# EasyEDA Pro project ProProject_AT_START_L021_V1.0.epro, schematic AT-START-L021_V1.0

## Sheets
1 AT-Link-EZ V1.4: Create Date: 2024-01-02; Page Name: AT-Link-EZ V1.4; Project Name: AT-START-L021; Schematic Name: AT-START-L021_V1.0; Update Date: 2024-02-21; Company: Artery Technology; Drawed: SD; Page Size: A4; Version: 1.0
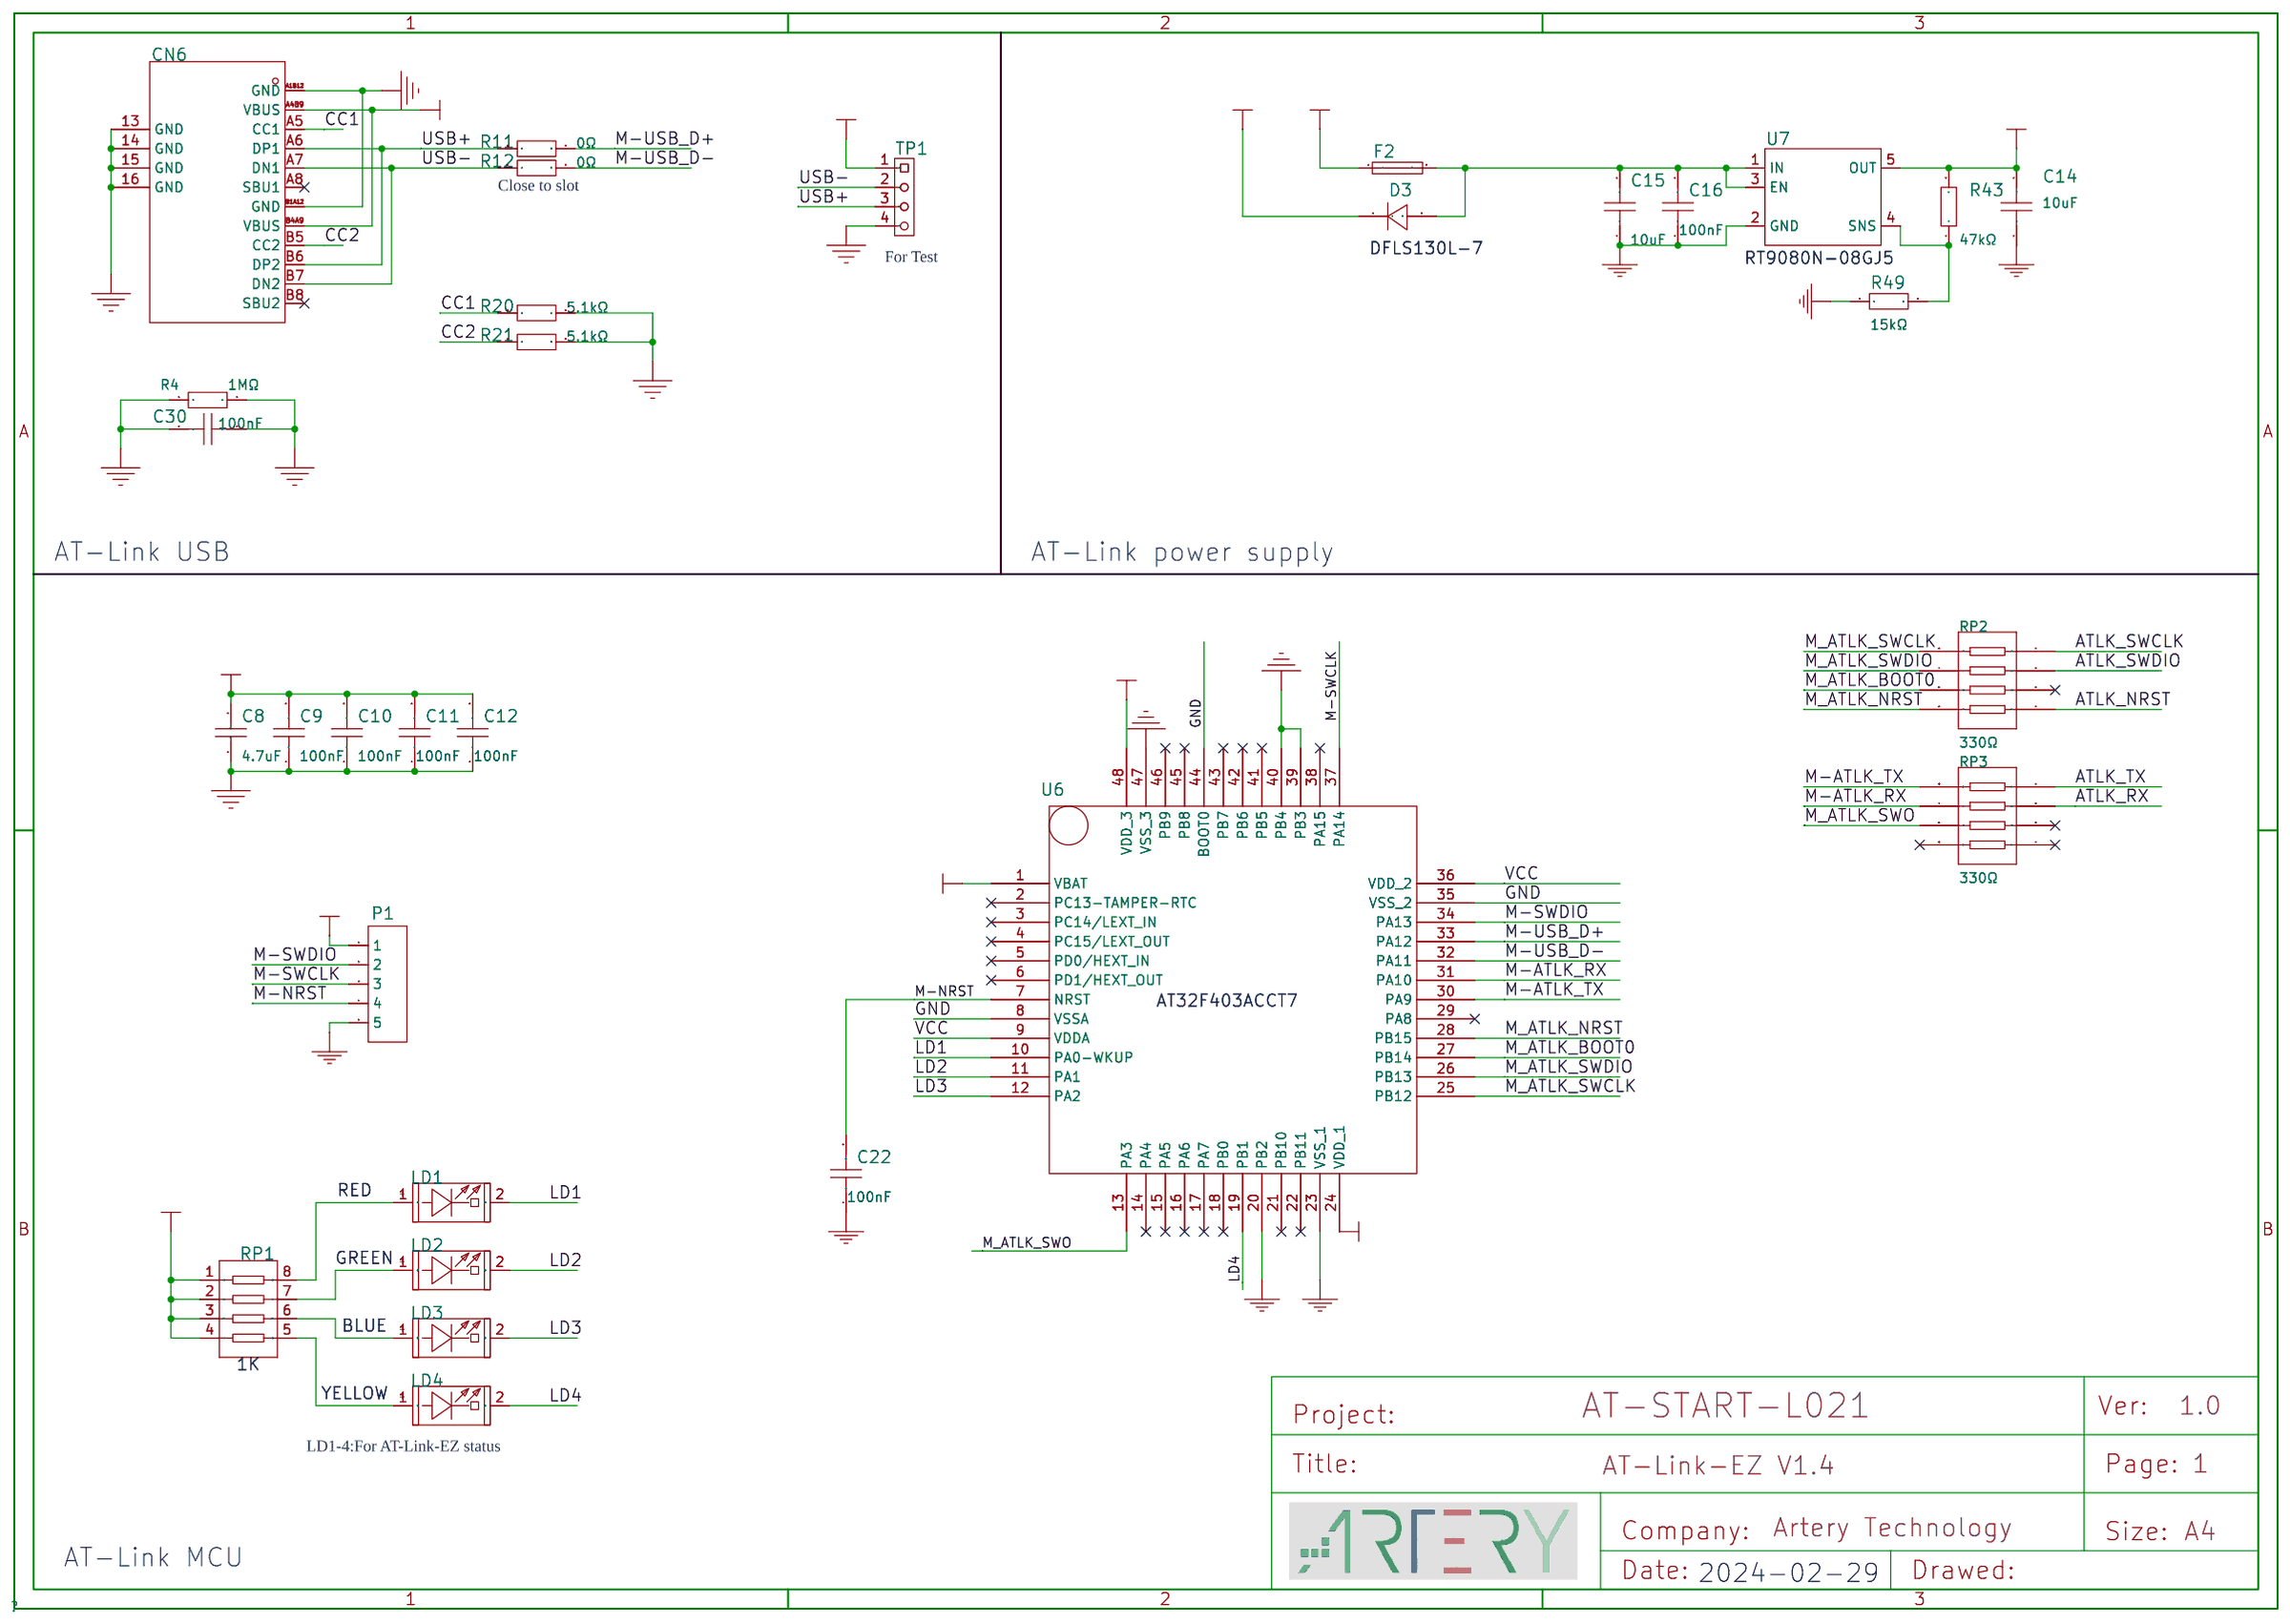
[diagram p0: AT-Link-EZ V1.4]
2 MCU: Page Name: MCU
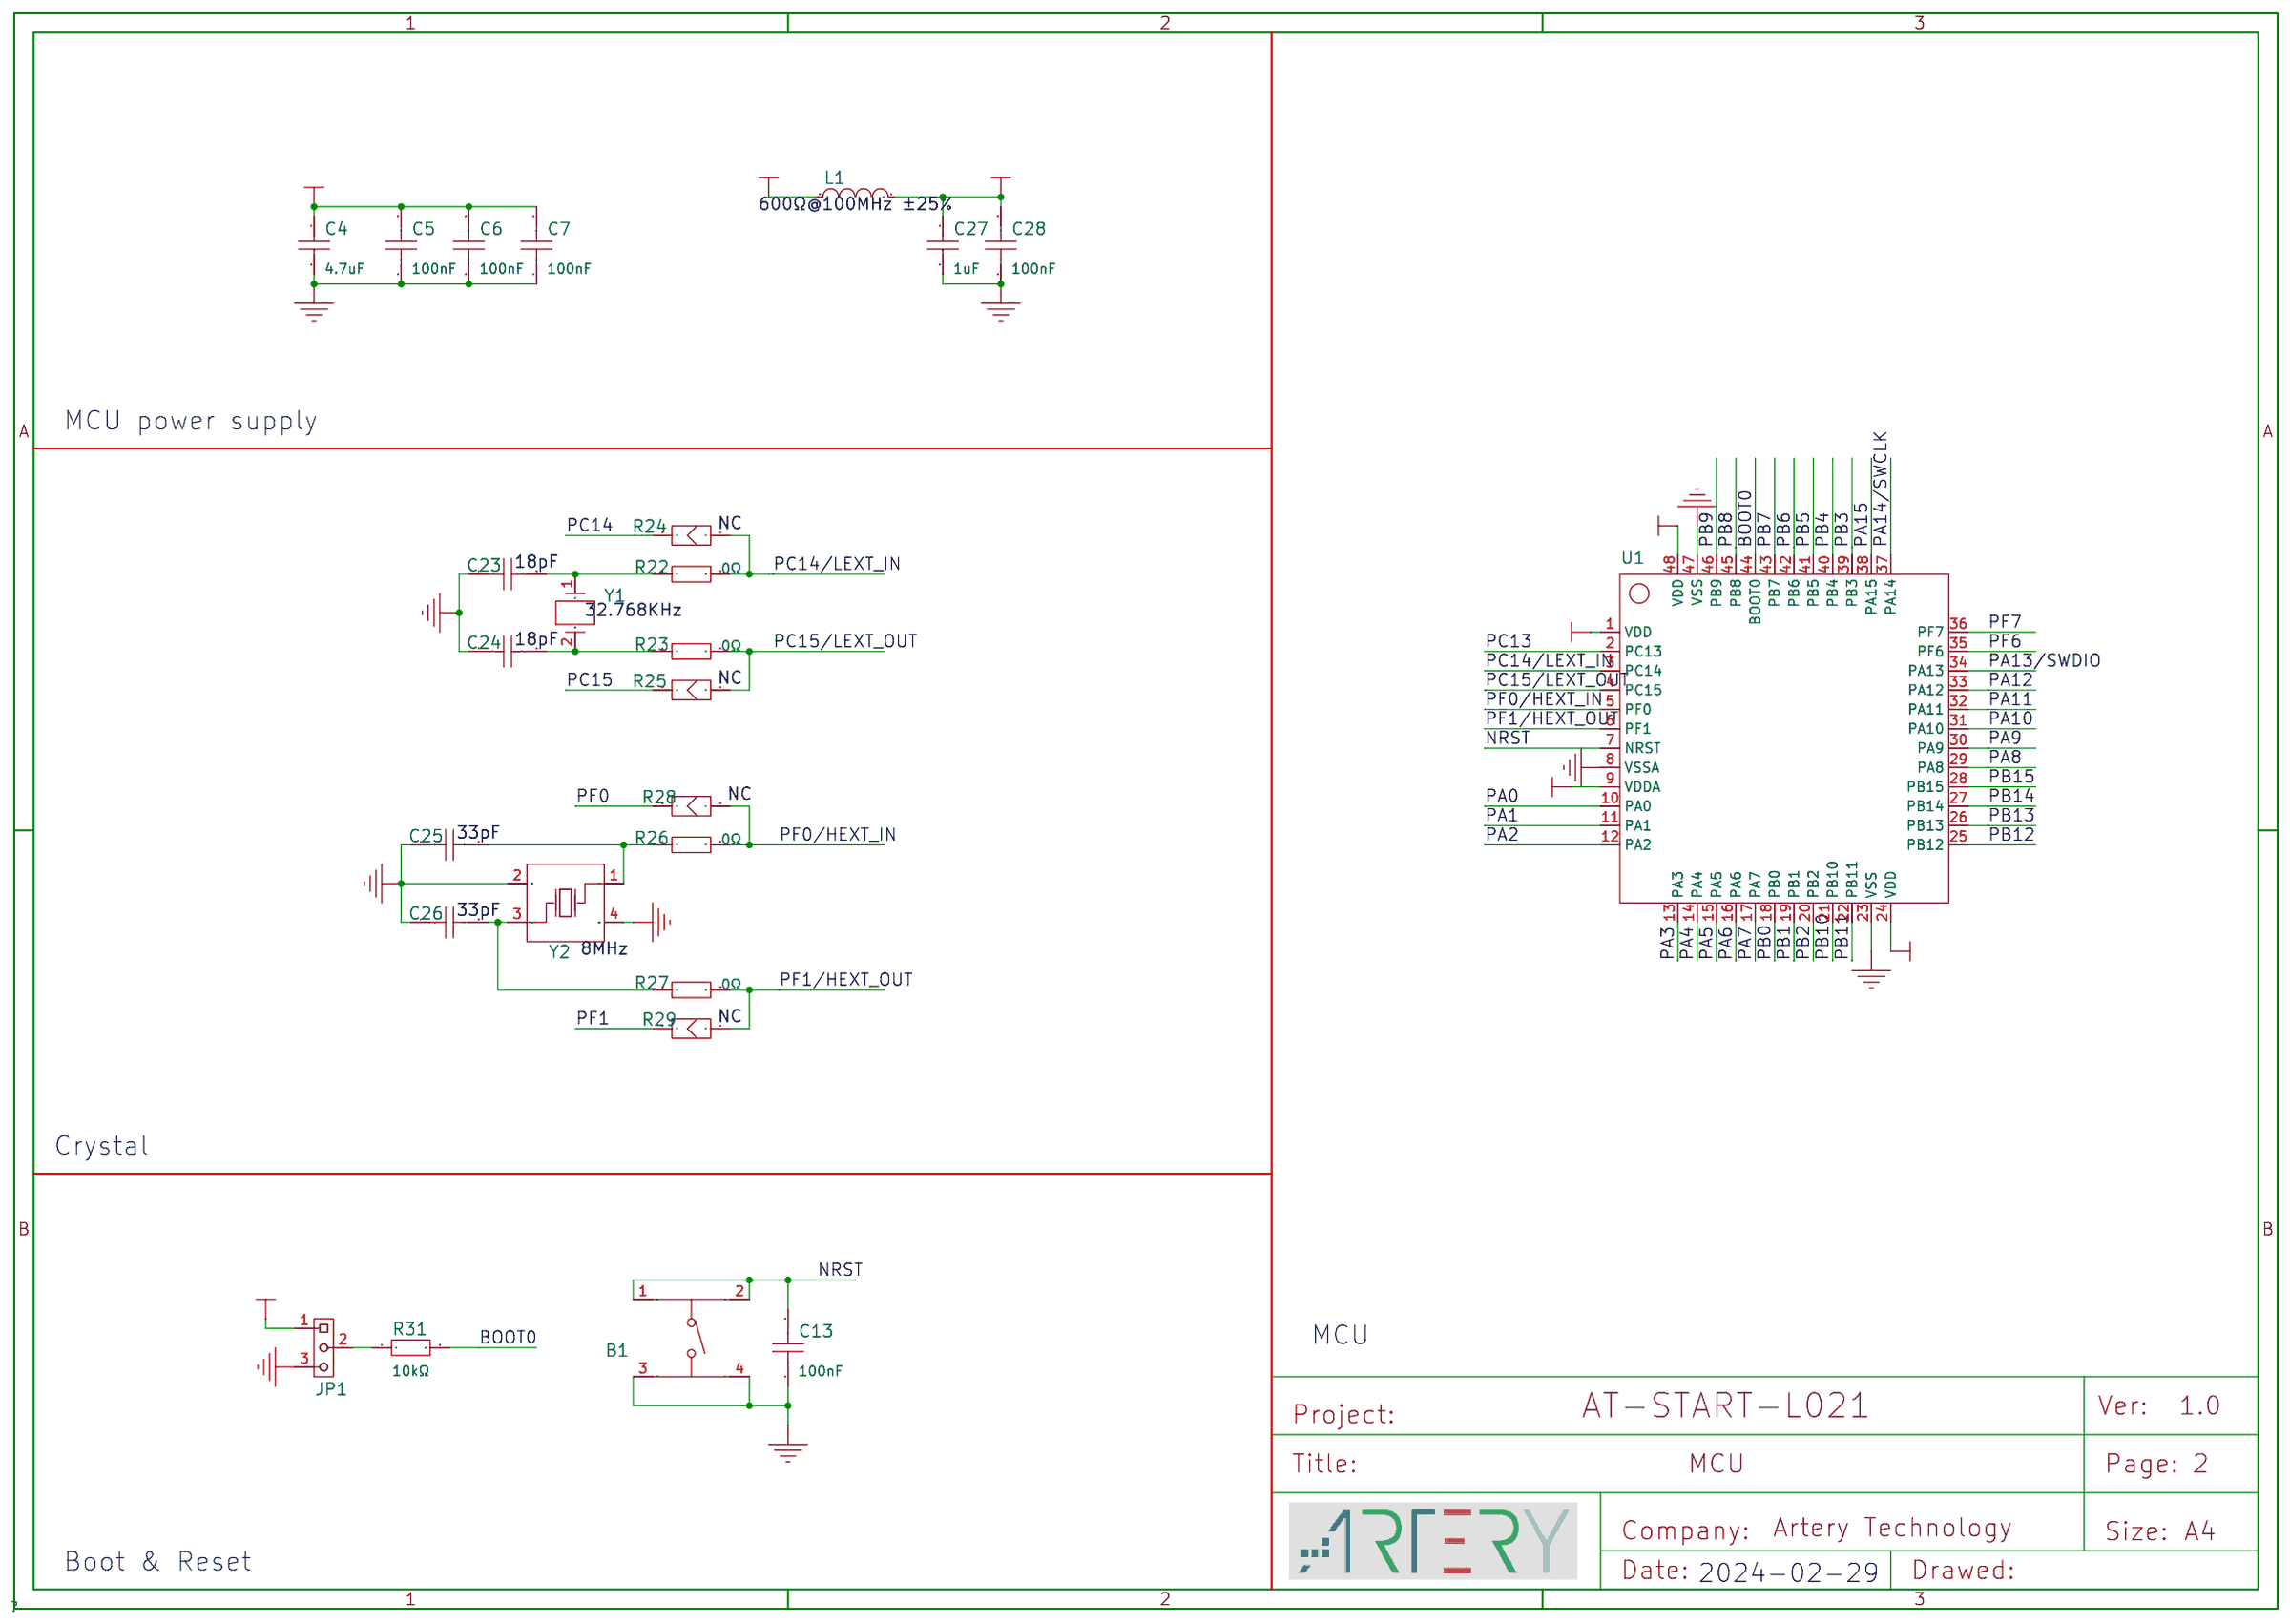
[diagram p1: MCU]
3 PowerPeripherals: Page Name: PowerPeripherals
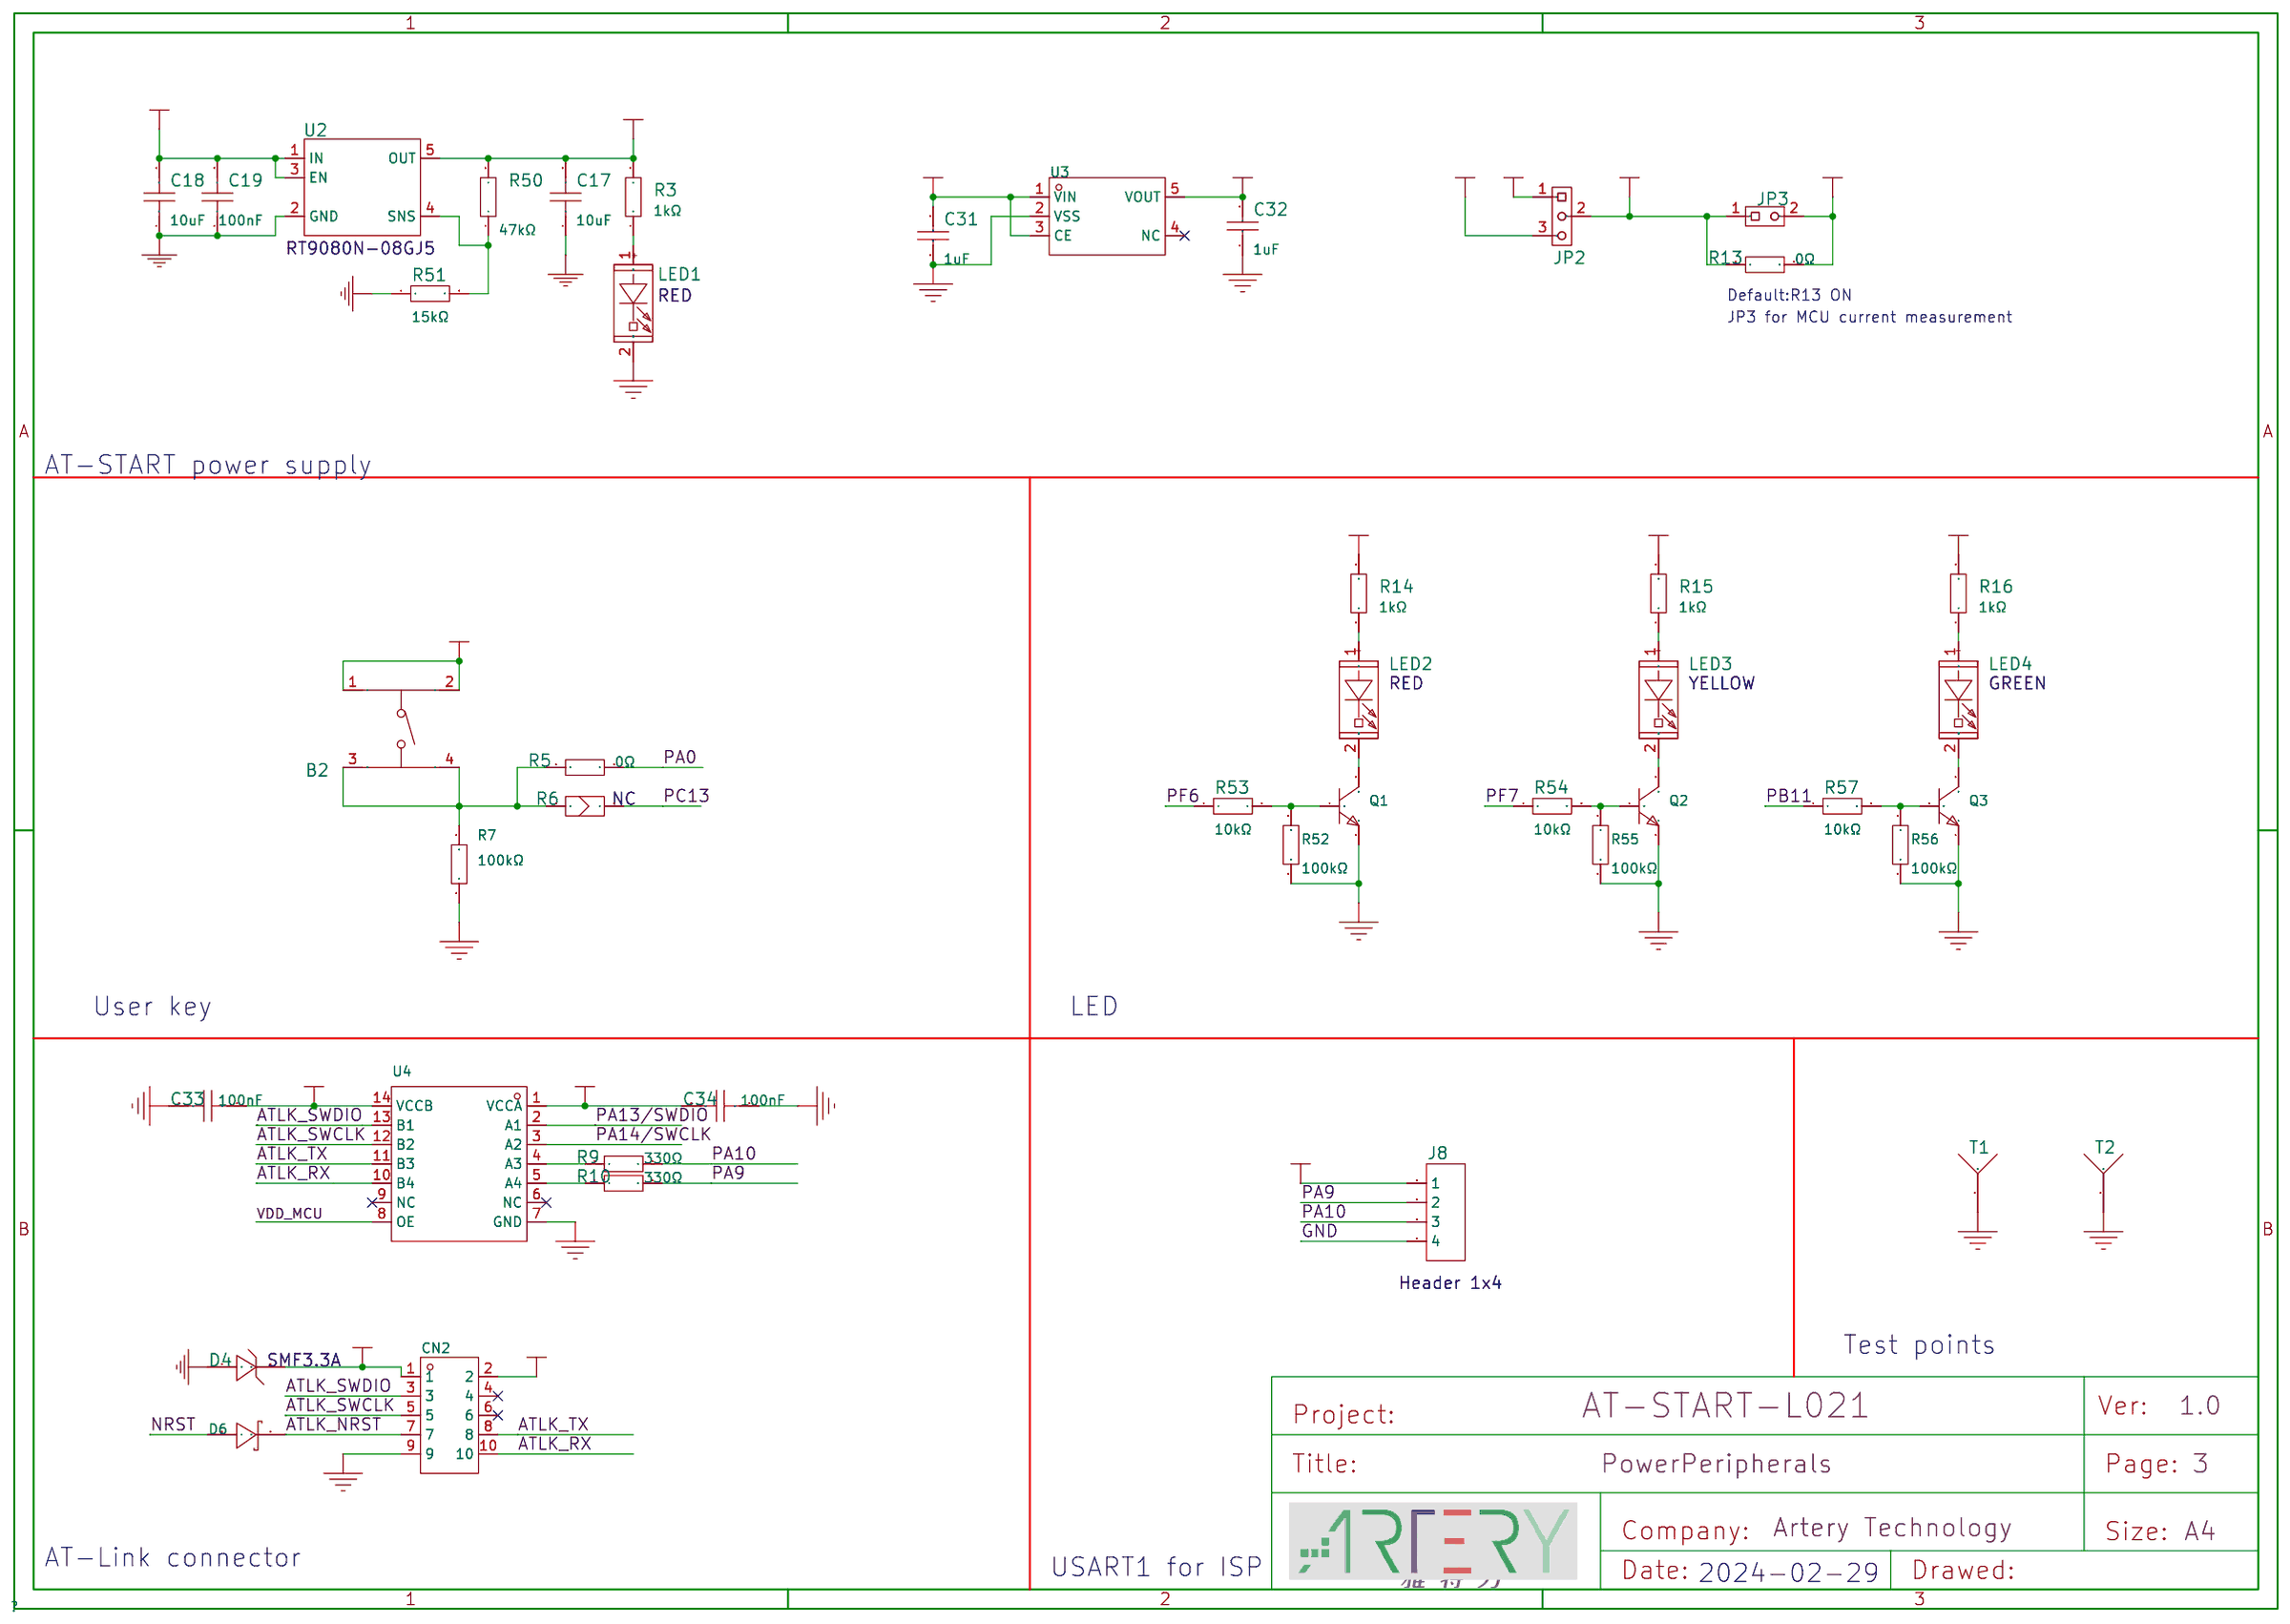
[diagram p2: PowerPeripherals]
4 Connectors: Page Name: Connectors
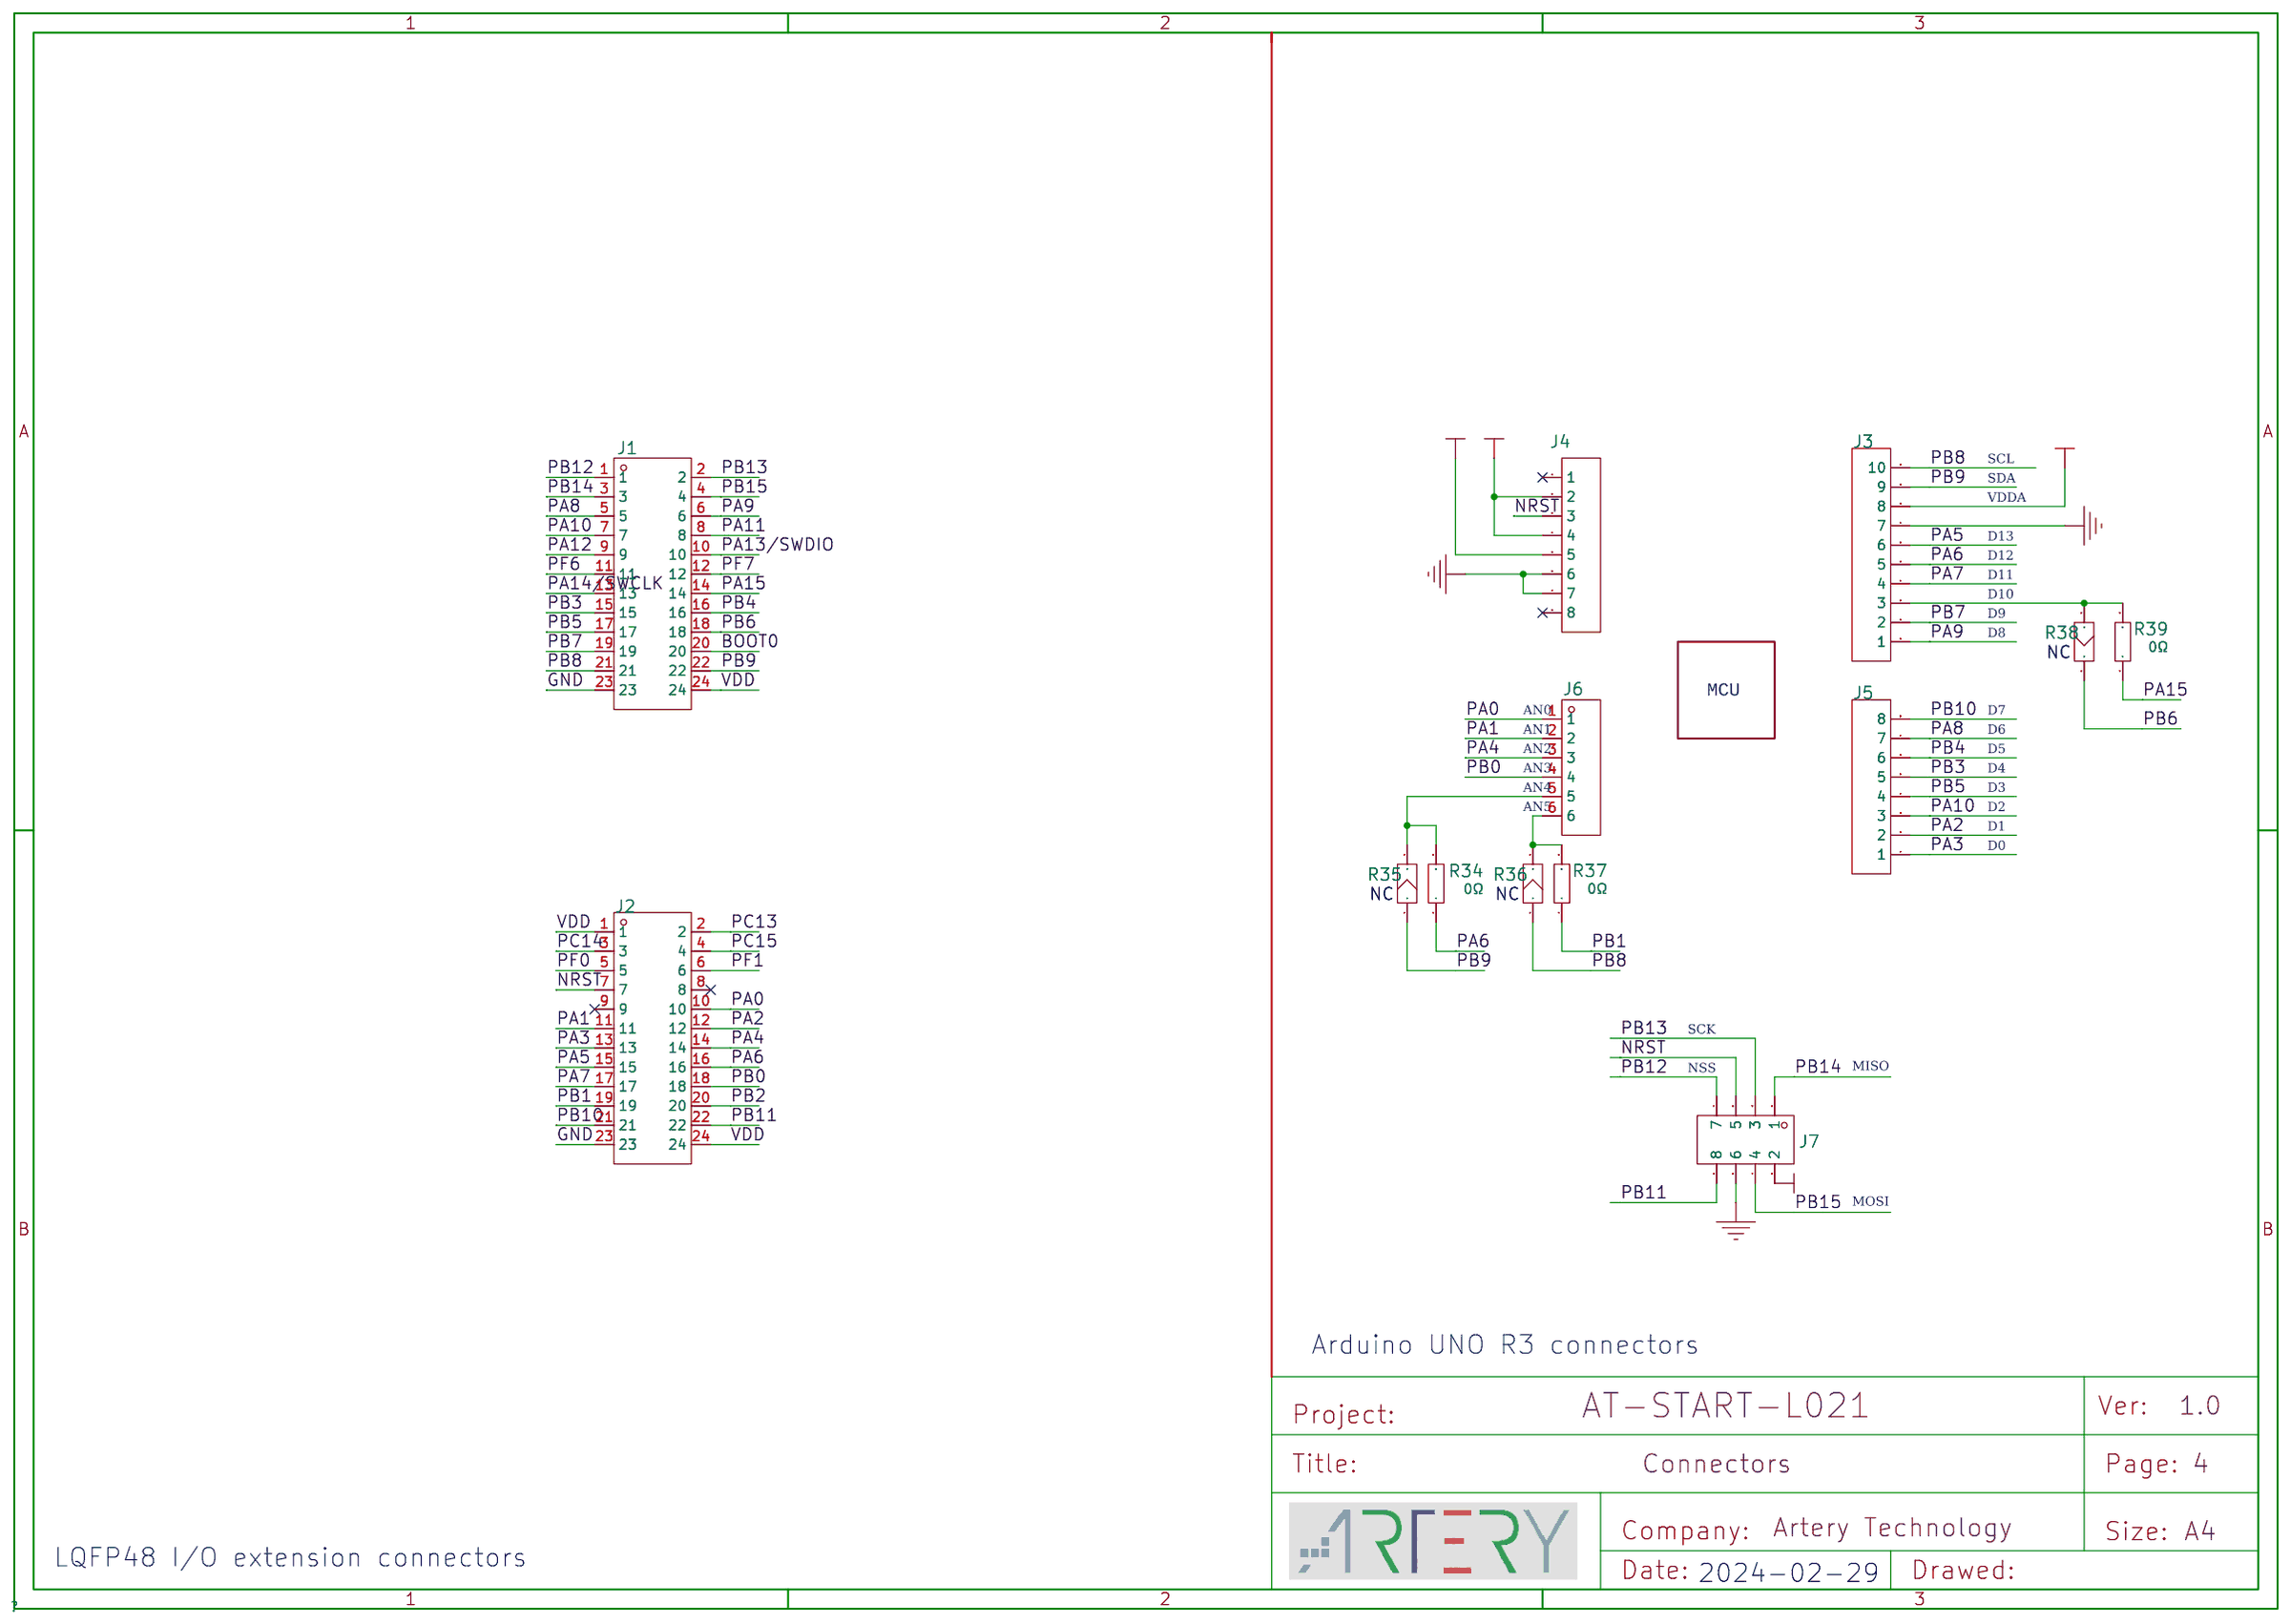
[diagram p3: Connectors]

## Parts
sheet AT-Link-EZ V1.4
C8  4.7uF  [C0603]
C9  100nF  [C0603]
C10  100nF  [C0603]
C11  100nF  [C0603]
C12  100nF  [C0603]
C14  10uF  [C0603]
C15  10uF  [C0603]
C16  100nF  [C0603]
C22  100nF  [C0603]
C30  100nF  [C0603]
CN6  -  [USB-C-SMD_TYPEC-304-BCP16]
D3  DFLS130L-7  [POWERDI-123_L2.8-W1.8-LS3.7-RD]
F2  SMD0603B050TF  [R0603]
LD1  RED  [LED0603]
LD2  GREEN  [LED0603]
LD3  BLUE  [LED0603]
LD4  YELLOW  [LED0603]
P1  HDR-M-2.54_1x5  [HDR-M-2.54_1X5]
R4  1MΩ  [R0603]
R11  0Ω  [R0603]
R12  0Ω  [R0603]
R20  5.1kΩ  [R0603]
R21  5.1kΩ  [R0603]
R43  47kΩ  [R0603]
R49  15kΩ  [R0603]
RP1  1K  [0603*4,8P4R]
RP2  330Ω  [RES-ARRAY-SMD_0603-8P-L3.2-W1.6-BL]
RP3  330Ω  [RES-ARRAY-SMD_0603-8P-L3.2-W1.6-BL]
TP1  1X4P_2.54F  [HDR1X4 - TOP]
U6  AT32F403ACCT7  [LQFP48 - 2]
U7  RT9080N-08GJ5  [SOT-23-5(1)]
sheet Connectors
J1  -  [HDR-TH_24P-P2.54-V-M-R2-C12-S2.54]
J2  -  [HDR-TH_24P-P2.54-V-M-R2-C12-S2.54]
J3  -  [AT-START-Connector 1x10]
J4  -  [AT-START-Connector 1x8]
J5  -  [AT-START-Connector 1x8]
J6  -  [AT-START-Connector 1x6]
J7  Header 4X2  [HDR2X4]
R34  0Ω  [R0603]
R35  NC  [SB-PAD]
R36  NC  [SB-PAD]
R37  0Ω  [R0603]
R38  NC  [SB-PAD]
R39  0Ω  [R0603]
sheet MCU
B1  K2-1102SP-C4SC-04  [BUTTON_SMT_6*6*5]
C4  4.7uF  [C0603]
C5  100nF  [C0603]
C6  100nF  [C0603]
C7  100nF  [C0603]
C13  100nF  [C0603]
C23  18pF  [C0603]
C24  18pF  [C0603]
C25  33pF  [C0603]
C26  33pF  [C0603]
C27  1uF  [C0603]
C28  100nF  [C0603]
JP1  Header 1x3  [HEADER 1X3]
L1  600Ω@100MHz ±25%  [L0603]
R22  0Ω  [R0603]
R23  0Ω  [R0603]
R24  NC  [SB-PAD]
R25  NC  [SB-PAD]
R26  0Ω  [R0603]
R27  0Ω  [R0603]
R28  NC  [SB-PAD]
R29  NC  [SB-PAD]
R31  10kΩ  [R0603]
U1  -  [LQFP-48_L7.0-W7.0-P0.50-LS9.0-BL]
Y1  32.768KHz  [XTAL_SOP - FC-12M]
Y2  8MHz  [OSC-SMD_4P-L5.0-W3.2-BL]
sheet PowerPeripherals
B2  蓝色  [BUTTON_SMT_6*6*5]
C17  10uF  [C0603]
C18  10uF  [C0603]
C19  100nF  [C0603]
C31  1uF  [C0603]
C32  1uF  [C0603]
C33  100nF  [C0603]
C34  100nF  [C0603]
CN2  -  [HDR-TH_10P-P2.54-V-M-R2-C5-S2.54]
D4  SMF3.3A  [SOD-123_L2.8-W1.8-LS3.7-RD]
D6  LRB521S-40T1G  [SOD-523_L1.2-W0.8-LS1.6-RD]
J8  Header 1x4  [HDR1X4]
JP2  Header 1x3  [HEADER 1X3]
JP3  NC(Header 1x2)  [HDR1X2]
LED1  RED  [LED0603]
LED2  RED  [LED0603]
LED3  YELLOW  [LED0603]
LED4  GREEN  [LED0603]
Q1  SS8050  [SOT-23-3_L2.9-W1.3-P1.90-LS2.4-BR]
Q2  SS8050  [SOT-23-3_L2.9-W1.3-P1.90-LS2.4-BR]
Q3  SS8050  [SOT-23-3_L2.9-W1.3-P1.90-LS2.4-BR]
R3  1kΩ  [R0603]
R5  0Ω  [R0603]
R6  NC  [SB-PAD]
R7  100kΩ  [R0603]
R9  330Ω  [R0603]
R10  330Ω  [R0603]
R13  0Ω  [R0603]
R14  1kΩ  [R0603]
R15  1kΩ  [R0603]
R16  1kΩ  [R0603]
R50  47kΩ  [R0603]
R51  15kΩ  [R0603]
R52  100kΩ  [R0603]
R53  10kΩ  [R0603]
R54  10kΩ  [R0603]
R55  100kΩ  [R0603]
R56  100kΩ  [R0603]
R57  10kΩ  [R0603]
T1  Testpoint  [TESTHOOK]
T2  Testpoint  [TESTHOOK]
U2  RT9080N-08GJ5  [SOT-23-5]
U3  ME6211C18M5G-N  [SOT-23-5_L3.0-W1.7-P0.95-LS2.8-BR]
U4  AIPTS0104TA14.TR  [TSSOP-14_L5.0-W4.4-P0.65-LS6.4-BL]

## Library data of the parts
C4 C8 = CL10A475KO8NNNC: 容值:4.7uF;精度:±10%;额定电压:16V;温度系数:X5R;; LCSC Part Name: 4.7uF ±10% 16V; Supplier Part: C19666; Manufacturer: SAMSUNG(三星); Supplier Footprint: 0603; JLCPCB Part Class: Basic Part; Datasheet: https://atta.szlcsc.com/upload/public/pdf/source/20160103/1457707703134.pdf; Supplier: LCSC; Tolerance: ±10%; Voltage Rated: 16V; Temperature Coefficient: X5R
C5-C7 C9-C13 C16 C19 C22 C28 C30 C33 C34 = CC0603KRX7R9BB104: 容值:100nF;精度:±10%;额定电压:50V;温度系数:X7R;; LCSC Part Name: 100nF ±10% 50V; Supplier Part: C14663; Manufacturer: YAGEO(国巨); Supplier Footprint: 0603; JLCPCB Part Class: Basic Part; Datasheet: https://atta.szlcsc.com/upload/public/pdf/source/20170116/1484561234239.pdf; Supplier: LCSC; Tolerance: ±10%; Voltage Rated: 50V; Temperature Coefficient: X7R
C14 C15 C17 C18 = CL10A106KP8NNNC: 容值:10uF;精度:±10%;额定电压:10V;温度系数:X5R;; LCSC Part Name: 10uF ±10% 10V; Supplier Part: C19702; Manufacturer: SAMSUNG(三星); Supplier Footprint: 0603; JLCPCB Part Class: Basic Part; Datasheet: https://atta.szlcsc.com/upload/public/pdf/source/20160103/1457707703378.pdf; Supplier: LCSC; Tolerance: ±10%; Voltage Rated: 10V; Temperature Coefficient: X5R
CN6 = TYPEC-304-BCP16: 连接器类型:Type-C;标准:USB 3.1;公母:母座;触点数量:16.0;端口数量:1;安装方式:卧贴;额定电流 - 电源:3A;工作温度范围:-25~+85;焊接温度(最大值):260;; Supplier Part: C720629; Manufacturer: XUNPU(讯普); Supplier Footprint: SMD; JLCPCB Part Class: Extended Part; Datasheet: https://atta.szlcsc.com/upload/public/pdf/source/20211022/DACD6552F639E9483017DE6DC0E61150.pdf; Supplier: LCSC; Connector Type: Type-C; Standard: USB 3.1; Gender: 母座; Number of Contacts: 16.0; Number of Ports: 1; Mounting Sytle: 卧贴; Current Rating - Power (Max): 3A; Operating Temperature Range: -25~+85; Welding Temperature (Max): 260
D3 = DFLS130L-7_POWERDI-123_L2.8-W1.8-LS3.7-RD: Supplier: LCSC; Supplier Part: C110493; Manufacturer: Diodes Incorporated; Paste Type: expand
F2 = SMD0603B050TF: Supplier: LCSC; Supplier Part: C269154; Manufacturer: Brightking Elec (TAIWAN); Manufacturer Part: SMD0603B035TF; Paste Type: expand
LD1 = RED
LD2 = GREEN
LD3 = BLUE
LD4 = YELLOW
P1 = HDR-M-2.54_1x5: Supplier Part: C358687; Supplier: LCSC
R4 = RC0603FR-071ML: 阻值:1MΩ;精度:±1%;功率:100mW;温度系数:±100ppm/;最大工作电压:75V;工作温度范围:-55~+155;; LCSC Part Name: 1MΩ ±1%; Supplier Part: C105578; Manufacturer: YAGEO(国巨); Supplier Footprint: 0603; JLCPCB Part Class: Extended Part; Datasheet: https://atta.szlcsc.com/upload/public/pdf/source/20181102/C105578_67A9388250AF143DE4682E62257D2969.pdf; Supplier: LCSC; Tolerance: ±1%; Power(Watts): 100mW; Temperature Coefficient: ±100ppm/; Overload Voltage (Max): 75V; Operating Temperature Range: -55~+155
R5 R11-R13 R22 R23 R26 R27 R34 R37 R39 = 0603WAF0000T5E: 电阻类型:厚膜电阻;阻值:0Ω;精度:±1%;功率:1/10W;温度系数:-;最大工作电压:75V;工作温度范围:-55~+155;; LCSC Part Name: 0Ω ±1%; Supplier Part: C21189; Manufacturer: UNI-ROYAL(厚声); Supplier Footprint: 0603; JLCPCB Part Class: Basic Part; Datasheet: https://atta.szlcsc.com/upload/public/pdf/source/20200306/C422600_1E6D84923E4A46A82E41ADD87F860B5C.pdf; Supplier: LCSC; Type: 厚膜电阻; Tolerance: ±1%; Power(Watts): 1/10W; Overload Voltage (Max): 75V; Operating Temperature Range: -55~+155
R20 R21 = 0603WAF5101T5E: 电阻类型:厚膜电阻;阻值:5.1kΩ;精度:±1%;功率:1/10W;温度系数:±100ppm/;最大工作电压:75V;工作温度范围:-55~+155;; LCSC Part Name: 5.1kΩ ±1%; Supplier Part: C23186; Manufacturer: UNI-ROYAL(厚声); Supplier Footprint: 0603; JLCPCB Part Class: Basic Part; Datasheet: https://atta.szlcsc.com/upload/public/pdf/source/20200306/C422600_1E6D84923E4A46A82E41ADD87F860B5C.pdf; Supplier: LCSC; Type: 厚膜电阻; Tolerance: ±1%; Power(Watts): 1/10W; Temperature Coefficient: ±100ppm/; Overload Voltage (Max): 75V; Operating Temperature Range: -55~+155
R43 R50 = 0603WAF4702T5E: 电阻类型:厚膜电阻;阻值:47kΩ;精度:±1%;功率:1/10W;温度系数:±100ppm/;最大工作电压:75V;工作温度范围:-55~+155;; LCSC Part Name: 47kΩ ±1%; Supplier Part: C25819; Manufacturer: UNI-ROYAL(厚声); Supplier Footprint: 0603; JLCPCB Part Class: Basic Part; Datasheet: https://atta.szlcsc.com/upload/public/pdf/source/20200306/C422600_1E6D84923E4A46A82E41ADD87F860B5C.pdf; Supplier: LCSC; Type: 厚膜电阻; Tolerance: ±1%; Power(Watts): 1/10W; Temperature Coefficient: ±100ppm/; Overload Voltage (Max): 75V; Operating Temperature Range: -55~+155
R49 R51 = 0603WAF1502T5E: 电阻类型:厚膜电阻;阻值:15kΩ;精度:±1%;功率:1/10W;温度系数:±100ppm/;最大工作电压:75V;工作温度范围:-55~+155;; LCSC Part Name: 15kΩ ±1%; Supplier Part: C22809; Manufacturer: UNI-ROYAL(厚声); Supplier Footprint: 0603; JLCPCB Part Class: Basic Part; Datasheet: https://atta.szlcsc.com/upload/public/pdf/source/20200306/C422600_1E6D84923E4A46A82E41ADD87F860B5C.pdf; Supplier: LCSC; Type: 厚膜电阻; Tolerance: ±1%; Power(Watts): 1/10W; Temperature Coefficient: ±100ppm/; Overload Voltage (Max): 75V; Operating Temperature Range: -55~+155
RP1 = 1K: Comment: 33R
RP2 RP3 = 4D03WGJ0331T5E: 阻值:330Ω;精度:±5%;单个元件功率:62.5mW;电阻器数:4;温度系数:±200ppm/℃;; LCSC Part Name: 330Ω ±5% 0603x4; Supplier Part: C12018; Manufacturer: UNI-ROYAL(厚声); Supplier Footprint: 0603x4; JLCPCB Part Class: 扩展库; Datasheet: https://atta.szlcsc.com/upload/public/pdf/source/20191224/C474318_2527498AE30E813171187CCD28401A71.pdf; Supplier: LCSC; Tolerance: ±5%; Power(Watts): 62.5mW; Number of Resistors: 4; Temperature Coefficient: ±200ppm/℃; Number of Pins: 8
TP1 = 1X4P_2.54F
U6 = AT32F403CGT6
U7 = RT9080N-08GJ5_SOT-23-5
J1 J2 = PZ254V-12-24P: 间距:2.54mm;总PIN位数:24;排数:2;插针结构:2x12P;行距:2.54mm;安装类型:直插;圆针/方针:方针;额定电流:-;额定电压:-;配合针长度:6mm;塑高:2.5mm;端接针长度:3mm;触头材质:黄铜;触头镀层:-;工作温度范围:-40~+105;颜色:黑色;; LCSC Part Name: 2.54mm 2x12P; Supplier Part: C492429; Manufacturer: XFCN(台湾兴飞); Supplier Footprint: 插件,P=2.54mm; JLCPCB Part Class: Extended Part; Datasheet: https://atta.szlcsc.com/upload/public/pdf/source/20200309/C492429_A90DEF30FD4D9CDC2C3DDFC5EAF9C00B.pdf; Supplier: LCSC; Pitch: 2.54mm; Number of Pins: 24; Number of Rows: 2; Pin Structure: 2x12P; Row Spacing: 2.54mm; Mounting Type: 直插; Circluar Pins/Square Pins: 方针; Length of Mating Pin: 6mm; Insulation Height: 2.5mm; Length of End Connection Pin: 3mm; Contact Material: 黄铜; Operating Temperature Range: -40~+105; Color: 黑色
J3 = 2.54-1*10P母: 间距:2.54mm;总孔位数:10;排数:1;插孔结构:1x10P;行距:-;安装类型:直插;塑高:-;触头材质:-;触头镀层:-;; LCSC Part Name: 2.54mm 镀金; Supplier Part: C35445; Manufacturer: BOOMELE(博穆精密); Supplier Footprint: 插件,P=2.54mm; JLCPCB Part Class: Extended Part; Datasheet: https://atta.szlcsc.com/upload/public/pdf/source/20200813/C35445_A4147CED0A1C9075722E373C7771E928.pdf; Supplier: LCSC; Pitch: 2.54mm; Number of Holes: 10; Number of Rows: 1; Holes Structure: 1x10P; Mounting Type: 直插
J4 J5 = 2.54-1*8P母环保: 间距:2.54mm;总孔位数:8;排数:1;插孔结构:1x8P;行距:-;安装类型:直插;塑高:-;触头材质:-;触头镀层:-;; LCSC Part Name: 2.54mm; Supplier Part: C27438; Manufacturer: BOOMELE(博穆精密); Supplier Footprint: 插件,P=2.54mm; JLCPCB Part Class: Extended Part; Datasheet: https://atta.szlcsc.com/upload/public/pdf/source/20151109/1457707554453.pdf; Supplier: LCSC; Pitch: 2.54mm; Number of Holes: 8; Number of Rows: 1; Holes Structure: 1x8P; Mounting Type: 直插
J6 = 2.54-1*6P母: 间距:2.54mm;总孔位数:6;排数:1;插孔结构:1x6P;行距:-;安装类型:直插;塑高:-;触头材质:-;触头镀层:-;; LCSC Part Name: 2.54mm; Supplier Part: C40877; Manufacturer: BOOMELE(博穆精密); Supplier Footprint: 插件,P=2.54mm; JLCPCB Part Class: Extended Part; Datasheet: https://atta.szlcsc.com/upload/public/pdf/source/20151109/1457707559772.pdf; Supplier: LCSC; Pitch: 2.54mm; Number of Holes: 6; Number of Rows: 1; Holes Structure: 1x6P; Mounting Type: 直插
J7 = Header 4X2: LatestRevisionDate: 17-Jul-2002; LatestRevisionNote: Re-released for DXP Platform.; Publisher: Altium Limited
R6 R24 R28 R29 R35 R36 R38 = NC_SB-PAD
B1 B2 = K2-1102SP-C4SC-04: 触点电流:50mA;额定电压(DC):12V;绝缘电阻:100MΩ;电路结构:单刀单掷;安装方式:立贴;按钮形状:圆形按钮;带灯:-;作用力:250gf@±30gf;机械寿命:100000;工作温度:-25℃~+85℃;开关长度:6mm;开关宽度:6mm;开关高度:5mm;; LCSC Part Name: K2-1102SP-C4SC-04 贴片; Supplier Part: C127509; Manufacturer: 韩国韩荣; Supplier Footprint: SMD; JLCPCB Part Class: Extended Part; Datasheet: https://atta.szlcsc.com/upload/public/pdf/source/20170914/C127509_1505359412282967685.pdf; Supplier: LCSC; Contact Current: 50mA; Voltage Rating (DC): 12V; Insulation Resistance: 100MΩ; Circuit: 单刀单掷; Mounting Style: 立贴; Actuator Style: 圆形按钮; Operating Force: 250gf@±30gf; Mechanical Life: 100000; Operating Temperature: -25℃~+85℃; Switch Length: 6mm; Switch Width: 6mm; Switch Height: 5mm
C23 C24 = CL10C180JB8NNNC: 容值:18pF;精度:±5%;额定电压:50V;材质(温度系数):C0G;; LCSC Part Name: 18pF ±5% 50V; Supplier Part: C1647; Manufacturer: SAMSUNG(三星); Supplier Footprint: 0603; JLCPCB Part Class: Basic Part; Datasheet: https://atta.szlcsc.com/upload/public/pdf/source/20160218/1457707763339.pdf; Supplier: LCSC; Tolerance: ±5%; Voltage Rated: 50V; Temperature Coefficient: C0G
C25 C26 = CL10C330JB8NNNC: 容值:33pF;精度:±5%;额定电压:50V;材质(温度系数):C0G;; LCSC Part Name: 33pF ±5% 50V; Supplier Part: C1663; Manufacturer: SAMSUNG(三星); Supplier Footprint: 0603; JLCPCB Part Class: Basic Part; Datasheet: https://atta.szlcsc.com/upload/public/pdf/source/20160218/1457707763339.pdf; Supplier: LCSC; Tolerance: ±5%; Voltage Rated: 50V; Temperature Coefficient: C0G
C27 C31 C32 = CL10A105KB8NNNC: 容值:1uF;精度:±10%;额定电压:50V;温度系数:X5R;; LCSC Part Name: 1uF ±10% 50V; Supplier Part: C15849; Manufacturer: SAMSUNG(三星); Supplier Footprint: 0603; JLCPCB Part Class: Basic Part; Datasheet: https://atta.szlcsc.com/upload/public/pdf/source/20160103/1457707679084.pdf; Supplier: LCSC; Tolerance: ±10%; Voltage Rated: 50V; Temperature Coefficient: X5R
JP1 JP2 = Header 1x3
L1 = UPZ1608E601-1R0TF: 标称阻抗@测试频率:600Ω@100MHz;误差:±25%;直流电阻(RDC):150mΩ;额定电流:1A;电路数:1;; Supplier Part: C133527; Manufacturer: Sunlord(顺络); Supplier Footprint: 0603; JLCPCB Part Class: Extended Part; Datasheet: https://atta.szlcsc.com/upload/public/pdf/source/20210916/3C06D8971A361A4569490E57F6B8A429.pdf; Supplier: LCSC; Impedance @ Frequency: 600Ω@100MHz; Tolerance: ±25%; DC Resistance: 150mΩ; Current Rating: 1A; Circuits: 1
R25 = NC
R31 R53 R54 R57 = 0603WAF1002T5E: 电阻类型:厚膜电阻;阻值:10kΩ;精度:±1%;功率:1/10W;温度系数:±100ppm/;最大工作电压:75V;工作温度范围:-55~+155;; LCSC Part Name: 10kΩ ±1%; Supplier Part: C25804; Manufacturer: UNI-ROYAL(厚声); Supplier Footprint: 0603; JLCPCB Part Class: Basic Part; Datasheet: https://atta.szlcsc.com/upload/public/pdf/source/20200306/C422600_1E6D84923E4A46A82E41ADD87F860B5C.pdf; Supplier: LCSC; Type: 厚膜电阻; Tolerance: ±1%; Power(Watts): 1/10W; Temperature Coefficient: ±100ppm/; Overload Voltage (Max): 75V; Operating Temperature Range: -55~+155
U1 = AT32L021C8T7: Manufacturer: ARTERY（雅特力）; Supplier Footprint: LQFP-48
Y1 = 32.768KHz
Y2 = 8MHz_OSC-SMD_4P-L5.0-W3.2-BL: Supplier: LCSC; Manufacturer: YXC; Manufacturer Part: X50328MSD4SC; Supplier Part: C16422; Paste Type: recommend
CN2 = Z-21310110021001: 间距:2.54mm;总PIN位数:10;排数:2;插针结构:-;行距:2.54mm;安装类型:直插;圆针/方针:-;额定电流:-;额定电压:-;配合针长度:-;塑高:-;触头材质:黄铜;触头镀层:-;颜色:黑色;; LCSC Part Name: 2.54mm; Supplier Part: C115170; Manufacturer: Nextron(台湾正凌); Supplier Footprint: 插件,P=2.54mm; JLCPCB Part Class: Extended Part; Datasheet: https://atta.szlcsc.com/upload/public/pdf/source/20170626/1498446033809.pdf; Supplier: LCSC; Pitch: 2.54mm; Number of Pins: 10; Number of Rows: 2; Row Spacing: 2.54mm; Mounting Type: 直插; Contact Material: 黄铜; Color: 黑色
D4 = SMF3.3A: Supplier: LCSC; Supplier Part: C283866; Manufacturer: DOWO; Paste Type: expand
D6 = LRB521S-40T1G: 直流反向耐压(Vr):40V;平均整流电流(Io):200mA;正向压降(Vf):300mV;; LCSC Part Name: 电压:40V 电流:200mA; Supplier Part: C135802; Manufacturer: LRC(乐山无线电); Supplier Footprint: SOD-523; JLCPCB Part Class: 扩展库; Datasheet: https://atta.szlcsc.com/upload/public/pdf/source/20180130/C135802_15172972979461323328.pdf; Supplier: LCSC; Reverse Voltage (Vr): 40V; Average Rectified Current (Io): 200mA; Forward Voltage (Vf@If): 300mV; Reverse Leakage Current (Ir): 20uA
J8 = Header 1x4: Supplier Part: C124378; Supplier: LCSC
JP3 = NC(Header 1x2)
LED1 = RED_LED0603(1)
LED2 = RED_LED0603
LED3 = YELLOW_LED0603
LED4 = GREEN_LED0603
Q1-Q3 = SS8050_C916392: 晶体管类型:-;集电极电流(Ic):-;集射极击穿电压(Vceo):-;功率(Pd):-;; Supplier Part: C916392; Manufacturer: JSMSEMI(杰盛微); Supplier Footprint: SOT-23; JLCPCB Part Class: 扩展库; Datasheet: https://atta.szlcsc.com/upload/public/pdf/source/20230807/CAABCAAF77D43CB838E37CFA5C9BFE5C.pdf; Supplier: LCSC
R3 R14-R16 = 0603WAF1001T5E: 电阻类型:厚膜电阻;阻值:1kΩ;精度:±1%;功率:1/10W;温度系数:±100ppm/;最大工作电压:75V;工作温度范围:-55~+155;; LCSC Part Name: 1kΩ ±1%; Supplier Part: C21190; Manufacturer: UNI-ROYAL(厚声); Supplier Footprint: 0603; JLCPCB Part Class: Basic Part; Datasheet: https://atta.szlcsc.com/upload/public/pdf/source/20200306/C422600_1E6D84923E4A46A82E41ADD87F860B5C.pdf; Supplier: LCSC; Type: 厚膜电阻; Tolerance: ±1%; Power(Watts): 1/10W; Temperature Coefficient: ±100ppm/; Overload Voltage (Max): 75V; Operating Temperature Range: -55~+155
R7 R52 R55 R56 = 0603WAF1003T5E: 电阻类型:厚膜电阻;阻值:100kΩ;精度:±1%;功率:1/10W;温度系数:±100ppm/;最大工作电压:75V;工作温度范围:-55~+155;; LCSC Part Name: 100kΩ ±1%; Supplier Part: C25803; Manufacturer: UNI-ROYAL(厚声); Supplier Footprint: 0603; JLCPCB Part Class: Basic Part; Datasheet: https://atta.szlcsc.com/upload/public/pdf/source/20200306/C422600_1E6D84923E4A46A82E41ADD87F860B5C.pdf; Supplier: LCSC; Type: 厚膜电阻; Tolerance: ±1%; Power(Watts): 1/10W; Temperature Coefficient: ±100ppm/; Overload Voltage (Max): 75V; Operating Temperature Range: -55~+155
R9 R10 = 0603WAF3300T5E: 阻值:330Ω;精度:±1%;功率:100mW;温度系数:±100ppm/℃;电阻类型:厚膜电阻;; LCSC Part Name: 330Ω ±1% 100mW 厚膜电阻; Supplier Part: C23138; Manufacturer: UNI-ROYAL(厚声); Supplier Footprint: 0603; JLCPCB Part Class: Basic Part; Datasheet: https://atta.szlcsc.com/upload/public/pdf/source/20200306/C422600_1E6D84923E4A46A82E41ADD87F860B5C.pdf; Supplier: LCSC; Tolerance: ±1%; Power(Watts): 100mW; Overload Voltage (Max): 75V; Temperature Coefficient: ±100ppm/℃; Type: 厚膜电阻; Operating Temperature Range: -55℃~+155℃
T1 = Testpoint_TESTHOOK: LatestRevisionDate: 17-Jul-2002; LatestRevisionNote: Re-released for DXP Platform.; Publisher: Altium Limited
T2 = Testpoint: LatestRevisionDate: 17-Jul-2002; LatestRevisionNote: Re-released for DXP Platform.; Publisher: Altium Limited
U2 = RT9080N-08GJ5
U3 = ME6211C18M5G-N: 输出类型:固定;输出极性:正;最大输入电压:6.5V;输出电压:1.8V;输出电流:300mA;电源纹波抑制比(PSRR):70dB@(1kHz);; LCSC Part Name: 输入6.5V 输出1.8V~1.8V 300mA; Supplier Part: C236671; Manufacturer: MICRONE(南京微盟); Supplier Footprint: SOT-23-5; JLCPCB Part Class: 扩展库; Datasheet: https://atta.szlcsc.com/upload/public/pdf/source/20180801/C94042_8FDAFF138ADDED65E3D077205E9A8C17.pdf; Supplier: LCSC; Output Type: 固定; Output Polarity: 正; Number of Outputs: 1; Maximum Input Voltage: 6.5V; Output Voltage: 1.8V; Dropout Voltage: 400mV@(200mA); Output Current: 300mA; Power Supply Rejection Ratio (PSRR): 70dB@(1kHz)
U4 = RS0104YQ: 电路数:1;每个电路通道数:4;电压(VCCA):1.65V~5.5V;电压(VCCB):2.3V~5.5V;数据速率:24Mbps;; Supplier Part: C5358052; Manufacturer: RUNIC(润石); Supplier Footprint: TSSOP-14; JLCPCB Part Class: 扩展库; Datasheet: https://atta.szlcsc.com/upload/public/pdf/source/20210326/C2762288_047AD9A0F3596B818F72E78761722A97.pdf; Supplier: LCSC; Channel Type: 双向; Number of Circuits: 1; Channels per Circuit: 4; Supply Voltage (VCCA): 1.65V~5.5V; Supply Voltage (VCCB): 2.3V~5.5V; Output Type: 推挽式；开路漏极; Data Rate: 24Mbps; Operating Temperature: -40℃~+85℃

## Nets
1V8: C32.2 JP2.1 U3.5(VOUT)
3V3: C17.2 C31.2 C33.1 CN2.1 D4.1 JP2.3 R3.2 R14.2 R15.2 R16.2 R50.2 U2.5(OUT) U3.1(VIN) U3.3(CE) U4.14(VCCB)
GND: B1.3 B1.4 C4.1 C5.1 C6.1 C7.1 C8.1 C9.1 C10.1 C11.1 C12.1 C13.1 C14.1 C15.1 C16.1 C17.1 C18.1 C19.1 C22.1 C23.1 C24.1 C25.1 C26.1 C27.1 C28.1 C30.1 C31.1 C32.1 C33.2 C34.1 CN2.9 CN6.A1B12(GND) CN6.B1A12(GND) D4.2 J1.23 J2.23 J3.7 J4.6 J4.7 J7.6 J8.4 JP1.3 LED1.2(CATHODE) P1.5 Q1.2(E) Q2.2(E) Q3.2(E) R4.2 R7.1 R20.2 R21.2 R49.1 R51.1 R52.1 R55.1 R56.1 T1.1 T2.1 TP1.4 U1.8(VSSA) U1.23(VSS) U1.47(VSS) U2.2(GND) U3.2(VSS) U4.7(GND) U6.8(VSSA) U6.20(PB2) U6.23(VSS_1) U6.35(VSS_2) U6.39(PB3) U6.40(PB4) U6.44(BOOT0) U6.47(VSS_3) U7.2(GND) Y2.2(GND) Y2.4(GND)
VCC: C8.2 C9.2 C10.2 C11.2 C12.2 C14.2 P1.1 R43.2 RP1.1 RP1.2 RP1.3 RP1.4 U6.1(VBAT) U6.9(VDDA) U6.24(VDD_1) U6.36(VDD_2) U6.48(VDD_3) U7.5(OUT)
VDD: B2.1 B2.2 C4.2 C5.2 C6.2 C7.2 J1.24 J2.1 J2.24 JP1.1 JP3.2 L1.1 R13.2 U1.1(VDD) U1.24(VDD) U1.48(VDD)
VDD_MCU: C34.2 J4.2 J4.4 J8.1 JP2.2 JP3.1 R13.1 U4.1(VCCA) U4.8(OE)
VDDA: C27.2 C28.2 J3.8 L1.2 U1.9(VDDA)
ATLINK_5V: CN6.A4B9(VBUS) CN6.B4A9(VBUS) F2.1 TP1.1
ATLK_NRST: CN2.7 D6.1(K) RP2.4
ATLK_RX: CN2.10 RP3.2 U4.10(B4)
ATLK_SWCLK: CN2.5 RP2.1 U4.12(B2)
ATLK_SWDIO: CN2.3 RP2.2 U4.13(B1)
ATLK_TX: CN2.8 RP3.1 U4.11(B3)
BOOT0: J1.20 R31.2 U1.44(BOOT0)
CC1: CN6.A5(CC1) R20.1
CC2: CN6.B5(CC2) R21.1
E5V: C18.2 C19.2 CN2.2 D3.1 J4.5 J7.2 U2.1(IN) U2.3(EN)
EGND: C30.2 CN6.13(GND) CN6.14(GND) CN6.15(GND) CN6.16(GND) R4.1
LD1: LD1.2(CATHODE) U6.10(PA0-WKUP)
LD2: LD2.2(CATHODE) U6.11(PA1)
LD3: LD3.2(CATHODE) U6.12(PA2)
LD4: LD4.2(CATHODE) U6.19(PB1)
M-ATLK_RX: RP3.7 U6.31(PA10)
M-ATLK_TX: RP3.8 U6.30(PA9)
M-NRST: C22.2 P1.4 U6.7(NRST)
M-SWCLK: P1.3 U6.37(PA14)
M-SWDIO: P1.2 U6.34(PA13)
M-USB_D+: R11.2 U6.33(PA12)
M-USB_D-: R12.2 U6.32(PA11)
M_ATLK_BOOT0: RP2.6 U6.27(PB14)
M_ATLK_NRST: RP2.5 U6.28(PB15)
M_ATLK_SWCLK: RP2.8 U6.25(PB12)
M_ATLK_SWDIO: RP2.7 U6.26(PB13)
M_ATLK_SWO: RP3.6 U6.13(PA3)
NRST: B1.1 B1.2 C13.2 D6.2(A) J2.7 J4.3 J7.5 U1.7(NRST)
PA0: J2.10 J6.1 R5.2 U1.10(PA0)
PA1: J2.11 J6.2 U1.11(PA1)
PA2: J2.12 J5.2 U1.12(PA2)
PA3: J2.13 J5.1 U1.13(PA3)
PA4: J2.14 J6.3 U1.14(PA4)
PA5: J2.15 J3.6 U1.15(PA5)
PA6: J2.16 J3.5 R34.1 U1.16(PA6)
PA7: J2.17 J3.4 U1.17(PA7)
PA8: J1.5 J5.7 U1.29(PA8)
PA9: J1.6 J3.1 J8.2 R10.2 U1.30(PA9)
PA10: J1.7 J5.3 J8.3 R9.2 U1.31(PA10)
PA11: J1.8 U1.32(PA11)
PA12: J1.9 U1.33(PA12)
PA13/SWDIO: J1.10 U1.34(PA13) U4.2(A1)
PA14/SWCLK: J1.13 U1.37(PA14) U4.3(A2)
PA15: J1.14 R39.1 U1.38(PA15)
PB0: J2.18 J6.4 U1.18(PB0)
PB1: J2.19 R37.1 U1.19(PB1)
PB2: J2.20 U1.20(PB2)
PB3: J1.15 J5.5 U1.39(PB3)
PB4: J1.16 J5.6 U1.40(PB4)
PB5: J1.17 J5.4 U1.41(PB5)
PB6: J1.18 R38.2 U1.42(PB6)
PB7: J1.19 J3.2 U1.43(PB7)
PB8: J1.21 J3.10 R36.1 U1.45(PB8)
PB9: J1.22 J3.9 R35.1 U1.46(PB9)
PB10: J2.21 J5.8 U1.21(PB10)
PB11: J2.22 J7.8 R57.1 U1.22(PB11)
PB12: J1.1 J7.7 U1.25(PB12)
PB13: J1.2 J7.3 U1.26(PB13)
PB14: J1.3 J7.1 U1.27(PB14)
PB15: J1.4 J7.4 U1.28(PB15)
PC13: J2.2 R6.2 U1.2(PC13)
PC14: J2.3 R24.2
PC14/LEXT_IN: R22.2 R24.1 U1.3(PC14)
PC15: J2.4 R25.2
PC15/LEXT_OUT: R23.2 R25.1 U1.4(PC15)
PF0: J2.5 R28.2
PF0/HEXT_IN: R26.2 R28.1 U1.5(PF0)
PF1: J2.6 R29.2
PF1/HEXT_OUT: R27.2 R29.1 U1.6(PF1)
PF6: J1.11 R53.1 U1.35(PF6)
PF7: J1.12 R54.1 U1.36(PF7)
USB+: CN6.A6(DP1) CN6.B6(DP2) R11.1 TP1.3
USB-: CN6.A7(DN1) CN6.B7(DN2) R12.1 TP1.2
$1N349: LD4.1(ANODE) RP1.5
$1N350: LD3.1(ANODE) RP1.6
$1N351: LD2.1(ANODE) RP1.7
$1N352: LD1.1(ANODE) RP1.8
$1N495: R43.1 R49.2 U7.4(SNS)
$1N28282: C15.2 C16.2 D3.2 F2.2 U7.1(IN) U7.3(EN)
$2N102: C25.2 R26.1 Y2.1(OSC1)
$2N103: C26.2 R27.1 Y2.3(OSC2)
$2N208: C24.2 R23.1 Y1.2
$2N210: C23.2 R22.1 Y1.1
$2N318: JP1.2 R31.1
$3N170: LED3.1(ANODE) R15.1
$3N172: LED4.1(ANODE) R16.1
$3N175: LED3.2(CATHODE) Q2.3(C)
$3N177: LED4.2(CATHODE) Q3.3(C)
$3N21573: B2.3 B2.4 R5.1 R6.1 R7.2
$3N23578: R10.1 U4.5(A4)
$3N26346: R50.1 R51.2 U2.4(SNS)
$3N27254: LED1.1(ANODE) R3.1
$3N29129: R9.1 U4.4(A3)
$3N31026: LED2.1(ANODE) R14.1
$3N31027: LED2.2(CATHODE) Q1.3(C)
$3N31068: Q1.1(B) R52.2 R53.2
$3N31207: Q2.1(B) R54.2 R55.2
$3N31389: Q3.1(B) R56.2 R57.2
$4N197: J6.5 R34.2 R35.2
$4N198: J6.6 R36.2 R37.2
$4N262: J3.3 R38.1 R39.2

Not connected (* = marked no-connect by the designer): CN2 4* 6*; CN6 A8(SBU1)* B8(SBU2)*; J2 8* 9*; J4 1* 8*; RP2 3*; RP3 3* 4* 5*; U3 4(NC)*; U4 6(NC)* 9(NC)*; U6 2(PC13-TAMPER-RTC)* 3(PC14/LEXT_IN)* 4(PC15/LEXT_OUT)* 5(PD0/HEXT_IN)* 6(PD1/HEXT_OUT)* 14(PA4)* 15(PA5)* 16(PA6)* 17(PA7)* 18(PB0)* 21(PB10)* 22(PB11)* 29(PA8)* 38(PA15)* 41(PB5)* 42(PB6)* 43(PB7)* 45(PB8)* 46(PB9)*

## Notes on the sheets
sheet 1
- Close to slot
- For Test
- AT-Link USB
- AT-Link power supply
- LD1-4:For AT-Link-EZ status
- AT-Link MCU
- 2024-02-29
sheet 2
- MCU power supply
- Crystal
- MCU
- Boot & Reset
- 2024-02-29
sheet 3
- Default:R13 ON
- JP3 for MCU current measurement
- AT-START power supply
- User key
- LED
- Test points
- AT-Link connector
- USART1 for ISP
- 2024-02-29
sheet 4
- SCL
- SDA
- VDDA
- D13
- D12
- D11
- D10
- D9
- D8
- MCU
- AN0
- D7
- AN1
- D6
- AN2
- AN3
- D4
- D5
- AN4
- D3
- AN5
- D2
- D1
- D0
- SCK
- MISO
- NSS
- MOSI
- Arduino UNO R3 connectors
- LQFP48 I/O extension connectors
- 2024-02-29
